# EAGLE design pocketmdm (EAGLE 7.2.0)
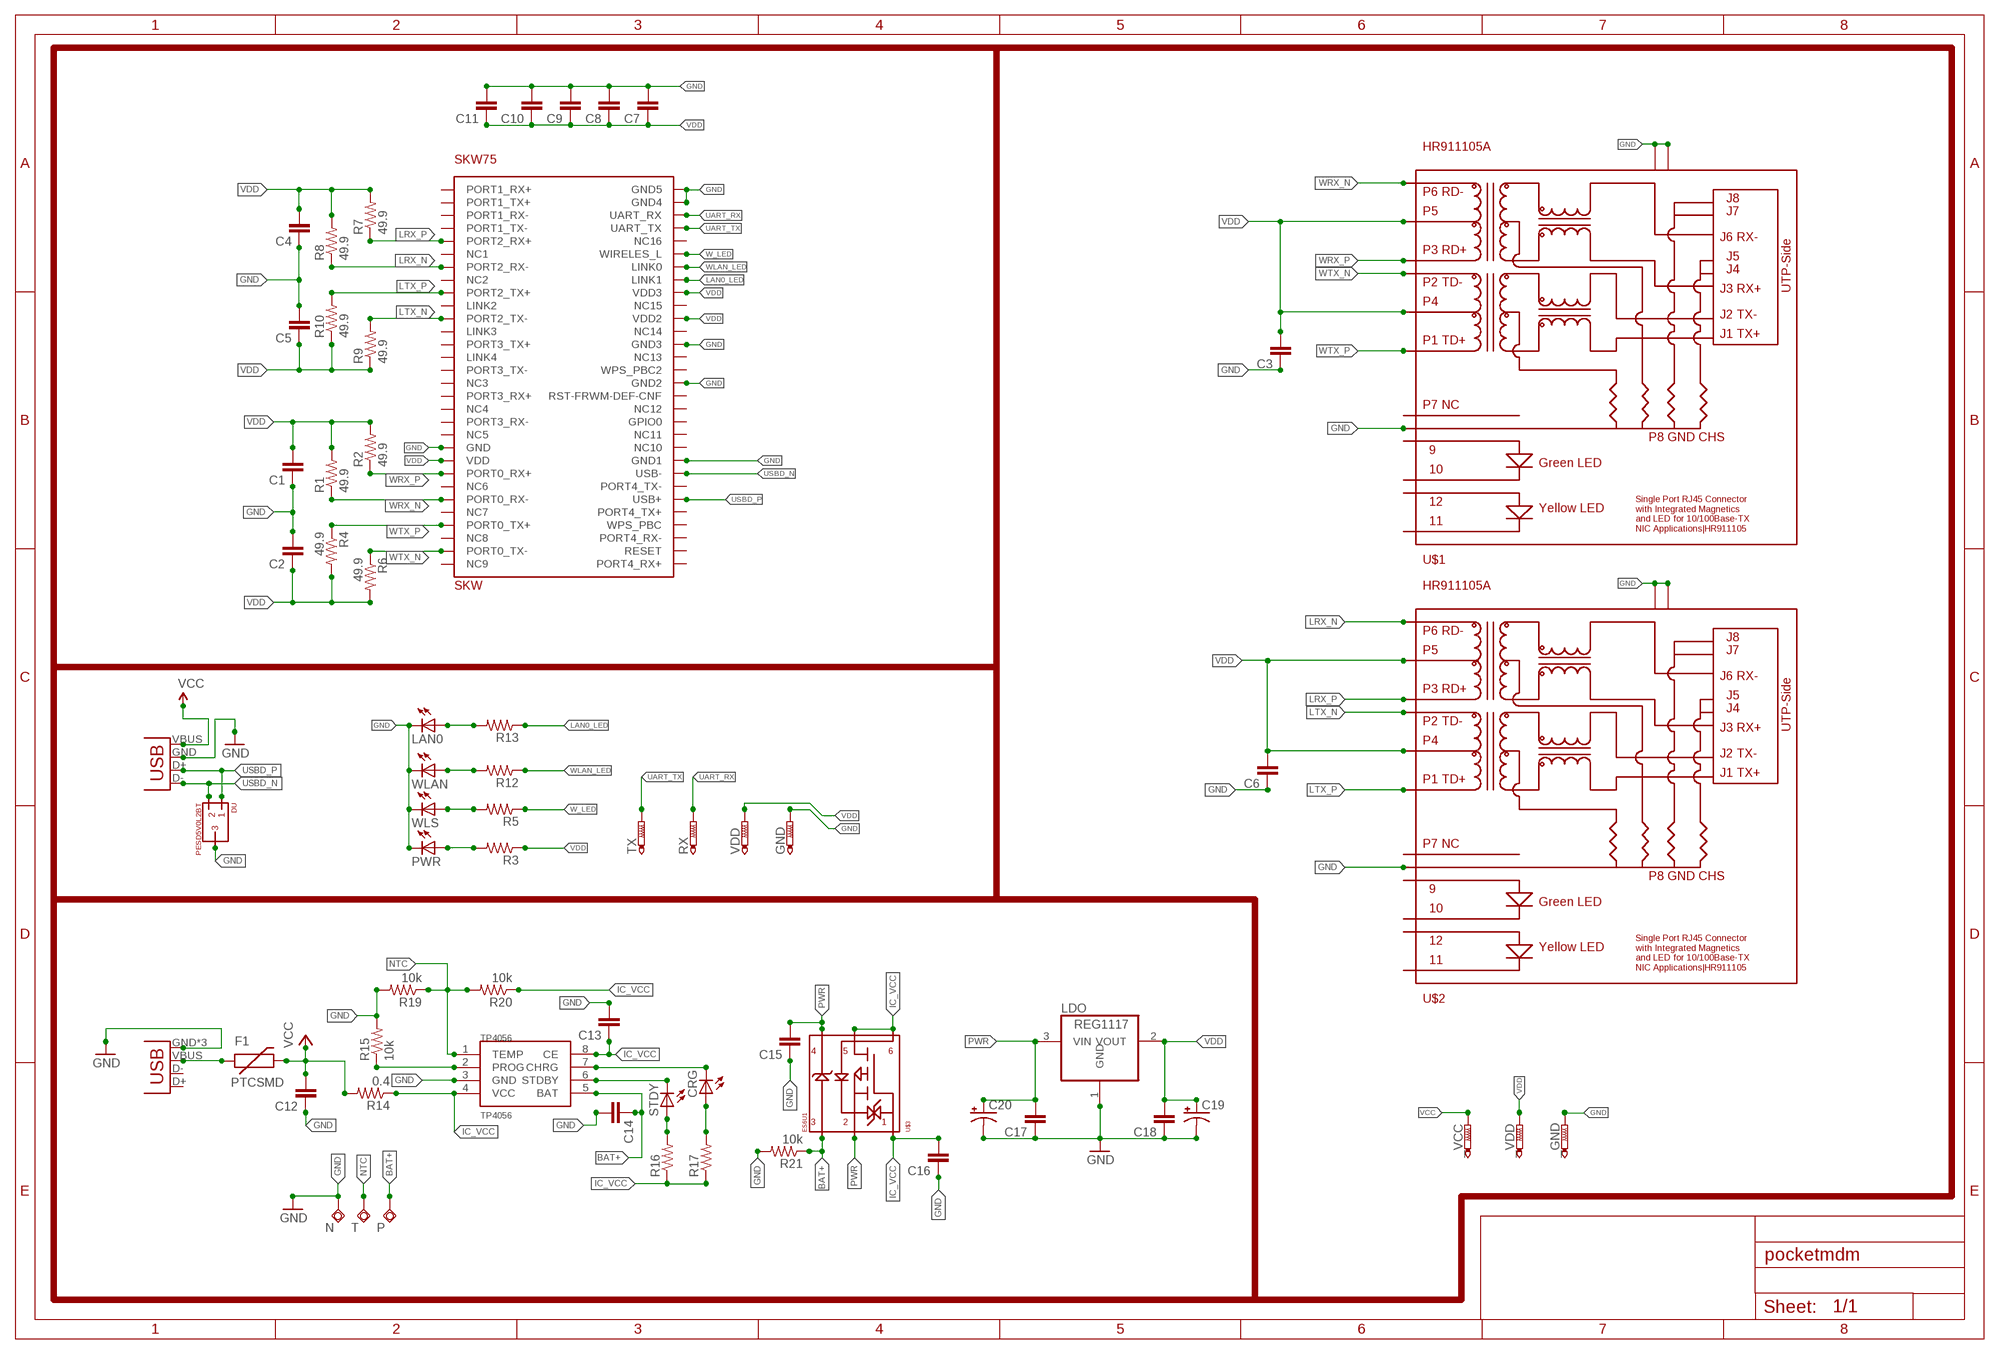
[diagram p0: schematic, sheet 1]

## Parts
_GND  PTR1B1,27  [B1,27]
_VCC  PTR1B1,27  [B1,27]
_VDD  PTR1B1,27  [B1,27]
C1  CAP0402-CAP  [0402-CAP]
C2  CAP0402-CAP  [0402-CAP]
C3  CAP0402-CAP  [0402-CAP]
C4  CAP0402-CAP  [0402-CAP]
C5  CAP0402-CAP  [0402-CAP]
C6  CAP0402-CAP  [0402-CAP]
C7  CAP0402-CAP  [0402-CAP]
C8  CAP0402-CAP  [0402-CAP]
C9  CAP0402-CAP  [0402-CAP]
C10  CAP0402-CAP  [0402-CAP]
C11  CAP0402-CAP  [0402-CAP]
C12  CAP0402-CAP  [0402-CAP]
C13  CAP0402-CAP  [0402-CAP]
C14  CAP0402-CAP  [0402-CAP]
C15  CAP0402-CAP  [0402-CAP]
C16  CAP0402-CAP  [0402-CAP]
C17  CAP0402-CAP  [0402-CAP]
C18  CAP0402-CAP  [0402-CAP]
C19  CAP_POLPTH1  [CPOL-RADIAL-100UF-25V]
C20  CAP_POLPTH1  [CPOL-RADIAL-100UF-25V]
CRG  LEDCHIPLED_0603  [CHIPLED_0603]
DU  PESD5V0L2BT  [SOT23]
F1  PTCSMD  [PTC-1206]
GND  PTR1B1,27  [B1,27]
LAN0  LEDCHIPLED_0603  [CHIPLED_0603]
LDO  REG1117  [SOT223]
N  TPSQTP20SQ  [TP20SQ]
P  TPSQTP20SQ  [TP20SQ]
PWR  LEDCHIPLED_0603  [CHIPLED_0603]
R1  49.9  RESISTOR0402-RES  [0402-RES]
R2  49.9  RESISTOR0402-RES  [0402-RES]
R3  RESISTOR0402-RES  [0402-RES]
R4  49.9  RESISTOR0402-RES  [0402-RES]
R5  RESISTOR0402-RES  [0402-RES]
R6  49.9  RESISTOR0402-RES  [0402-RES]
R7  49.9  RESISTOR0402-RES  [0402-RES]
R8  49.9  RESISTOR0402-RES  [0402-RES]
R9  49.9  RESISTOR0402-RES  [0402-RES]
R10  49.9  RESISTOR0402-RES  [0402-RES]
R12  RESISTOR0402-RES  [0402-RES]
R13  RESISTOR0402-RES  [0402-RES]
R14  0.4  RESISTOR0402-RES  [0402-RES]
R15  10k  RESISTOR0402-RES  [0402-RES]
R16  RESISTOR0402-RES  [0402-RES]
R17  RESISTOR0402-RES  [0402-RES]
R19  10k  RESISTOR0402-RES  [0402-RES]
R20  10k  RESISTOR0402-RES  [0402-RES]
R21  10k  RESISTOR0402-RES  [0402-RES]
RX  PTR1B1,27  [B1,27]
SKW  SKW75  [CON-60-127MMPTH]
STDY  LEDCHIPLED_0603  [CHIPLED_0603]
T  TPSQTP20SQ  [TP20SQ]
TP4056  TP4056  [SOP-8]
TX  PTR1B1,27  [B1,27]
U$1  HR911105A  [HR911105A]
U$2  HR911105A  [HR911105A]
U$3  ES6U1  [WEMT6]
USBA  USB-A-H  [USB-A-H]
USBM  USB-MICROB  [USB-MICROB]
VDD  PTR1B1,27  [B1,27]
WLAN  LEDCHIPLED_0603  [CHIPLED_0603]
WLS  LEDCHIPLED_0603  [CHIPLED_0603]

## Nets
BAT+: C14.1 P.TP R21.1 TP4056.5(BAT) U$3.P$3
GND: _GND.TP C1.1 C2.2 C3.1 C4.1 C5.2 C6.1 C7.2 C8.2 C9.2 C10.2 C11.2 C12.1 C13.2 C14.2 C15.1 C16.1 C17.1 C18.1 C19.2(-) C20.2(-) DU.3 GND.TP LAN0.C LDO.1(GND) N.TP PWR.C R15.2 R19.2 R21.2 SKW.P$21(GND) SKW.P$39(GND1) SKW.P$45(GND2) SKW.P$48(GND3) SKW.P$59(GND4) SKW.P$60(GND5) TP4056.3(GND) U$1.P$8 U$1.P$13 U$1.P$14 U$2.P$8 U$2.P$13 U$2.P$14 USBA.GND(VBUS) USBM.GND USBM.MT1(GND) USBM.MT2(GND) WLAN.C WLS.C
IC_VCC: C13.1 C16.2 R14.1 R16.1 R17.1 R20.1 TP4056.4(VCC) TP4056.8(CE) U$3.P$1 U$3.P$5 U$3.P$6
LAN0_LED: R13.1 SKW.P$53(LINK1)
LRX_N: R8.1 SKW.P$7(PORT2_RX-) U$2.P$6
LRX_P: R7.1 SKW.P$5(PORT2_RX+) U$2.P$3
LTX_N: R9.2 SKW.P$11(PORT2_TX-) U$2.P$2
LTX_P: R10.2 SKW.P$9(PORT2_TX+) U$2.P$1
N$2: CRG.C TP4056.7(CHRG)
N$4: F1.1 USBM.VBUS
N$7: R15.1 TP4056.2(PROG)
N$8: STDY.C TP4056.6(STDBY)
N$9: PWR.A R3.2
N$10: R5.2 WLS.A
N$11: R12.2 WLAN.A
N$16: R16.2 STDY.A
N$19: CRG.A R17.2
N$21: LAN0.A R13.2
NTC: R19.1 R20.2 T.TP TP4056.1(TEMP)
PWR: C15.2 C17.2 C20.1(+) LDO.3(VIN) U$3.P$2 U$3.P$4
UART_RX: RX.TP SKW.P$58(UART_RX)
UART_TX: SKW.P$57(UART_TX) TX.TP
USBD_N: DU.2 SKW.P$38(USB-) USBA.D-(D+)
USBD_P: DU.1 SKW.P$36(USB+) USBA.D+(D-)
VCC: _VCC.TP C12.2 F1.2 R14.2 USBA.VBUS(GND)
VDD: _VDD.TP C1.2 C2.1 C3.2 C4.2 C5.1 C6.2 C7.1 C8.1 C9.1 C10.1 C11.1 C18.2 C19.1(+) LDO.2(VOUT) R1.2 R2.2 R3.1 R4.2 R6.2 R7.2 R8.2 R9.1 R10.1 SKW.P$22(VDD) SKW.P$50(VDD2) SKW.P$52(VDD3) U$1.P$4 U$1.P$5 U$2.P$4 U$2.P$5 VDD.TP
W_LED: R5.1 SKW.P$55(WIRELES_L)
WLAN_LED: R12.1 SKW.P$54(LINK0)
WRX_N: R1.1 SKW.P$25(PORT0_RX-) U$1.P$6
WRX_P: R2.1 SKW.P$23(PORT0_RX+) U$1.P$3
WTX_N: R6.1 SKW.P$29(PORT0_TX-) U$1.P$2
WTX_P: R4.1 SKW.P$27(PORT0_TX+) U$1.P$1
Unconnected: SKW.P$1(PORT1_RX+) SKW.P$2(PORT1_TX+) SKW.P$3(PORT1_RX-) SKW.P$4(PORT1_TX-) SKW.P$6(NC1) SKW.P$8(NC2) SKW.P$10(LINK2) SKW.P$12(LINK3) SKW.P$13(PORT3_TX+) SKW.P$14(LINK4) SKW.P$15(PORT3_TX-) SKW.P$16(NC3) SKW.P$17(PORT3_RX+) SKW.P$18(NC4) SKW.P$19(PORT3_RX-) SKW.P$20(NC5) SKW.P$24(NC6) SKW.P$26(NC7) SKW.P$28(NC8) SKW.P$30(NC9) SKW.P$31(PORT4_RX+) SKW.P$32(RESET) SKW.P$33(PORT4_RX-) SKW.P$34(WPS_PBC) SKW.P$35(PORT4_TX+) SKW.P$37(PORT4_TX-) SKW.P$40(NC10) SKW.P$41(NC11) SKW.P$42(GPIO0) SKW.P$43(NC12) SKW.P$44(RST-FRWM-DEF-CNF) SKW.P$46(WPS_PBC2) SKW.P$47(NC13) SKW.P$49(NC14) SKW.P$51(NC15) SKW.P$56(NC16) U$1.P$7 U$1.P$9 U$1.P$10 U$1.P$11 U$1.P$12 U$2.P$7 U$2.P$9 U$2.P$10 U$2.P$11 U$2.P$12 USBM.D+ USBM.D-

## Library data of the parts
_GND _VCC _VDD GND RX TX VDD = testpad:PTR1: TEST PIN
C1-C18 = SparkFun-Capacitors:CAP: Capacitor Standard 0603 ceramic capacitor, and 0.1" leaded capacitor.
C19 C20 = SparkFun-Passives:CAP_POL: Capacitor Polarized These are standard SMD and PTH capacitors. Normally 10uF, 47uF, and 100uF in electrolytic and tantalum varieties. Always verify the external diameter of the through hole cap, it varies with capacity, voltage, and manufacturer. The EIA devices should be standard.
CRG LAN0 PWR STDY WLAN WLS = led:LED: LED OSRAM: - CHIPLED LG R971, LG N971, LY N971, LG Q971, LY Q971, LO R971, LY R971 LH N974, LH R974 LS Q976, LO Q976, LY Q976 LO Q996 - Hyper CHIPLED LW Q18S LB Q993, LB Q99A, LB R99A - SideLED LS A670, LO A670, LY A670, LG A670, LP A670 LB A673, LV A673, LT A673, LW A673 LH A674 LY A675 LS A676, LA A676, LO A676, LY A676, LW A676 LS A679, LY A679, LG A679 - Hyper Micro SIDELED® LS Y876, LA Y876, LO Y876, LY Y876 LT Y87S - SmartLED LW L88C, LW L88S LB L89C, LB L89S, LG L890 LS L89K, LO L89K, LY L89K LS L896, LA L896, LO L896, LY L896 - TOPLED LS T670, LO T670, LY T670, LG T670, LP T670 LSG T670, LSP T670, LSY T670, LOP T670, LYG T670 LG T671, LOG T671, LSG T671 LB T673, LV T673, LT T673, LW T673 LH T674 LS T676, LA T676, LO T676, LY T676, LB T676, LH T676, LSB T676, LW T676 LB T67C, LV T67C, LT T67C, LS T67K, LO T67K, LY T67K, LW E67C LS E67B, LA E67B, LO E67B, LY E67B, LB E67C, LV E67C, LT E67C LW T67C LS T679, LY T679, LG T679 LS T770, LO T770, LY T770, LG T770, LP T770 LB T773, LV T773, LT T773, LW T773 LH T774 LS E675, LA E675, LY E675, LS T675 LS T776, LA T776, LO T776, LY T776, LB T776 LHGB T686 LT T68C, LB T68C - Hyper Mini TOPLED® LB M676 - Mini TOPLED Santana® LG M470 LS M47K, LO M47K, LY M47K Source: http://www.osram.convergy.de LUXEON: - LUMILED® LXK2-PW12-R00, LXK2-PW12-S00, LXK2-PW14-U00, LXK2-PW14-V00 LXK2-PM12-R00, LXK2-PM12-S00, LXK2-PM14-U00 LXK2-PE12-Q00, LXK2-PE12-R00, LXK2-PE12-S00, LXK2-PE14-T00, LXK2-PE14-U00 LXK2-PB12-K00, LXK2-PB12-L00, LXK2-PB12-M00, LXK2-PB14-N00, LXK2-PB14-P00, LXK2-PB14-Q00 LXK2-PR12-L00, LXK2-PR12-M00, LXK2-PR14-Q00, LXK2-PR14-R00 LXK2-PD12-Q00, LXK2-PD12-R00, LXK2-PD12-S00 LXK2-PH12-R00, LXK2-PH12-S00 LXK2-PL12-P00, LXK2-PL12-Q00, LXK2-PL12-R00 Source: www.luxeon.com KINGBRIGHT: KA-3528ASYC Source: www.kingbright.com
DU = NXP_By_element14_Batch_1:PESD5V0L2BT
F1 = SparkFun-PowerIC:PTC: Resettable Fuse PTC Resettable Fuse. Spark Fun Electronics SKU : COM-08357; PROD_ID: RES-11150
LDO = burr-brown:REG1117: 800mA and 1A Low Dropout (LDO) Positive Regulator 1.8V, 2.5V, 2.85V, 3.3V, 5V, and Adj; MPN: REG1117; OC_FARNELL: 1097566; OC_NEWARK: 14P6981
N P T = testpad:TPSQ: Test pad
R1-R10 R12-R17 R19-R21 = SparkFun-Passives:RESISTOR: Resistor Basic schematic elements and footprints for 0603, 1206, and PTH resistors.
SKW = skw-75-lib:SKW75
TP4056 = TP4056:TP4056
U$1 U$2 = hanrun:HR911105A; LINK: http://www.aliexpress.com/item/Free-Shipping-20PCS-LOT-HR911105A-WIZNET-HR911105-HANRUN-Single-Port-RJ45-Connector-O-100/1039249300.html; PRICE: 0.67
U$3 = ES6U1:ES6U1
USBA = SparkFun-Connectors:USB: USB Connectors USB-B-PTH is fully proven SKU : PRT-00139/CONN-08278 USB-miniB is fully proven SKU : PRT-00587 USB-A-PCB is untested. USB-A-H is throughly reviewed, but untested. Spark Fun Electronics SKU : PRT-00437 USB-B-SMT is throughly reviewed, but untested. Needs silkscreen touching up. USB-A-S has not been used/tested USB-MB-H has not been used/tested USB-MICROB has been used. CONN-09505
USBM = SparkFun-Connectors:USB: USB Connectors USB-B-PTH is fully proven SKU : PRT-00139/CONN-08278 USB-miniB is fully proven SKU : PRT-00587 USB-A-PCB is untested. USB-A-H is throughly reviewed, but untested. Spark Fun Electronics SKU : PRT-00437 USB-B-SMT is throughly reviewed, but untested. Needs silkscreen touching up. USB-A-S has not been used/tested USB-MB-H has not been used/tested USB-MICROB has been used. CONN-09505; PROD_ID: CONN-09505

## Board
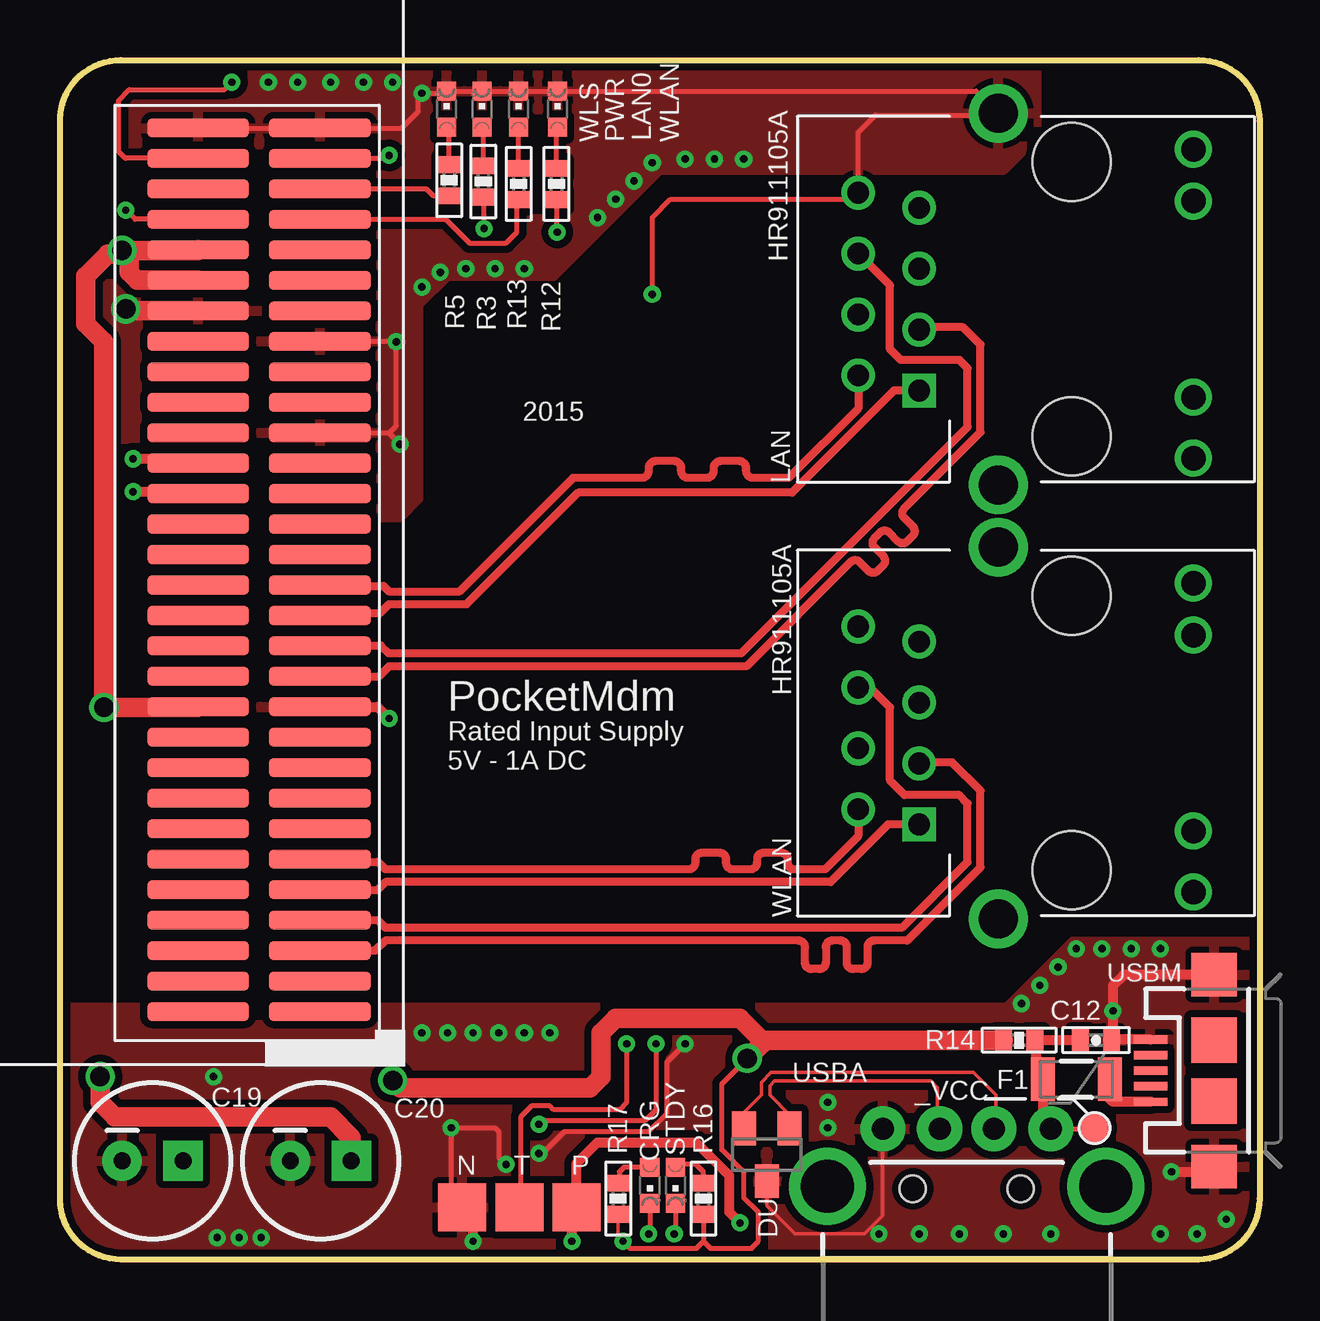
[diagram p1: board, top side]
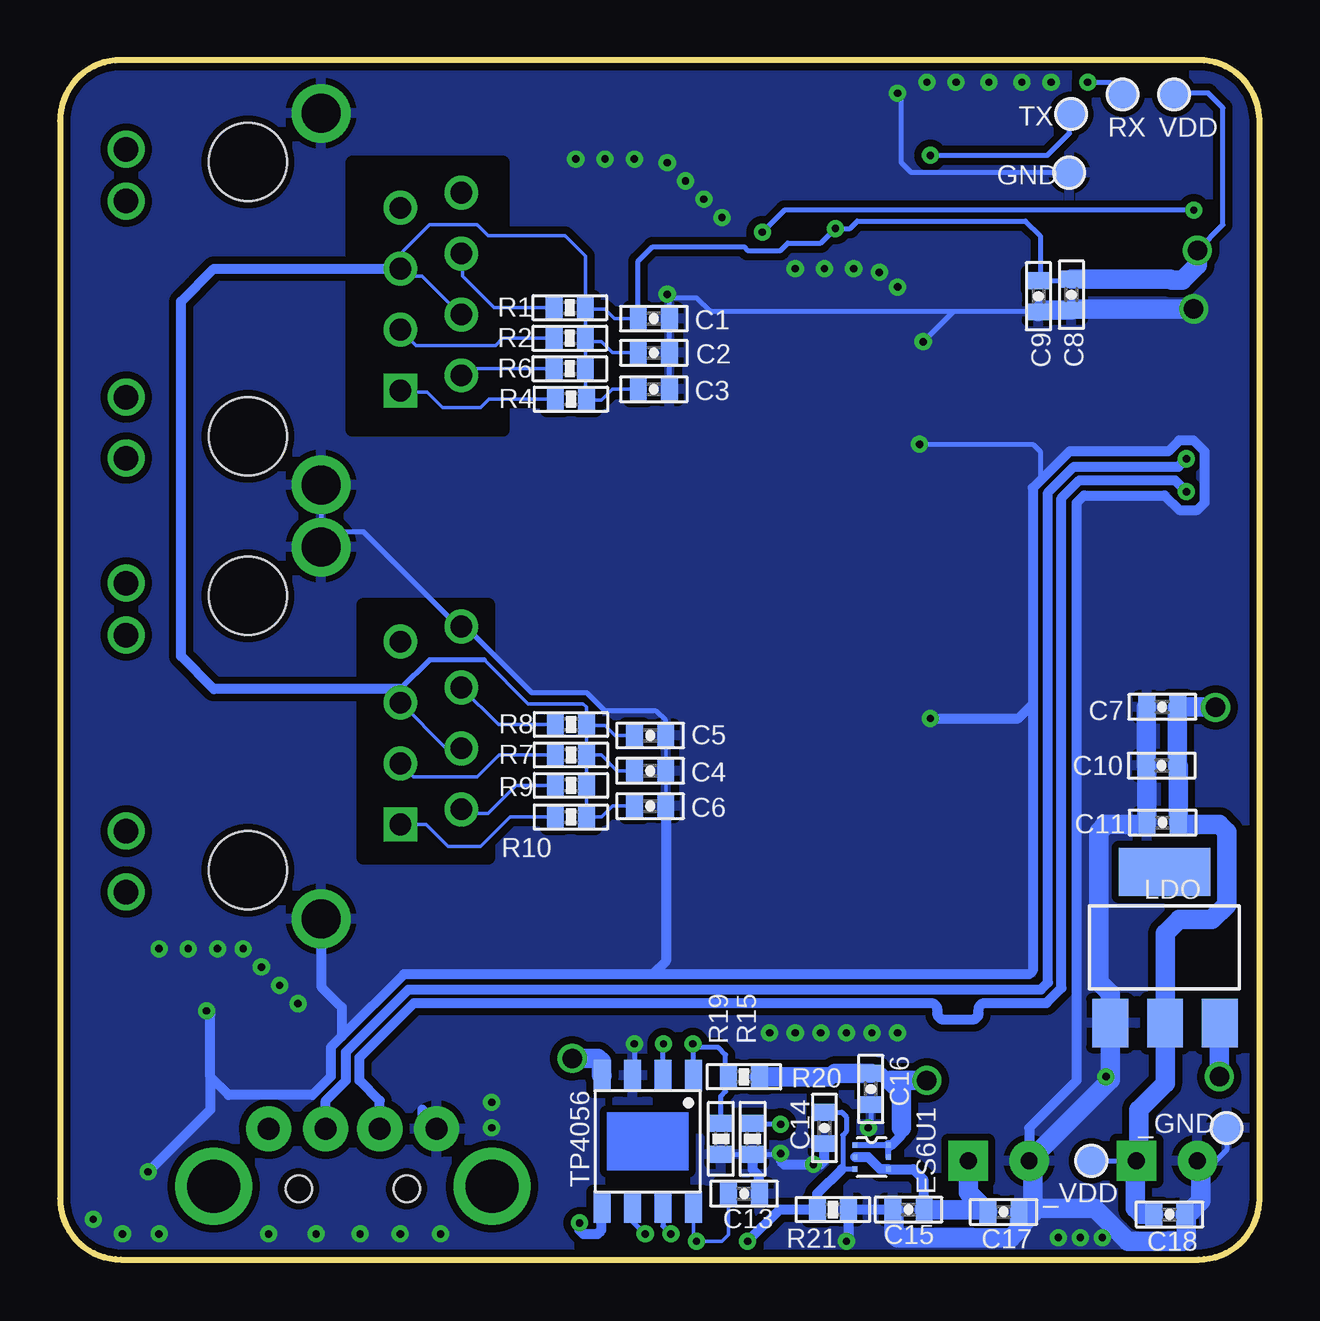
[diagram p2: board, bottom side, seen from below]

Size 50 x 50 mm. Coordinates in mm from the lower left corner, seen from the top.
Outline: 47.46,0 2.54,0 arc-90 0,2.54 0,47.46 arc-90 2.54,50 47.46,50 arc-90 50,47.46 50,2.54 arc-90 47.46,0
Copper layers (1*16): Top 0.035mm / dielectric 1.5mm / Bottom 0.035mm
Design rules "pocketmdm-dru *": minimum track width 6mil, minimum drill 12mil, track to track 6mil, track to pad 6mil, pad to pad 6mil, via to via 6mil, smd to smd 6mil, copper to edge 6mil, drill to drill 6mil, minimum pad ring 10mil, minimum via ring 8mil, stop-mask expansion 4mil, vias tented up to drill 0mil, thermal gap 10mil
bRestrict: area 32.2,16.8 to 37.3,27.3; area 31.5,34.6 to 37.8,45.7

### Footprints (pad centres in the part's own frame; a part is rotated, then mirrored left to right if it is on the bottom)
B1,27 = smd 1.27 x 1.27: TP 0,0
0402-CAP = smd 0.7 x 0.9: 1 -0.65,0; 2 0.65,0
CPOL-RADIAL-100UF-25V = drill 0.7 pad 1.651 square: 1 1.27,0 | drill 0.7 pad 1.651: 2 -1.27,0
CHIPLED_0603 = smd 0.8 x 0.8: A 0,-0.75; C 0,0.75
SOT23 = smd 1 x 1.4: 1 -0.95,-1.1; 2 0.95,-1.1; 3 0,1.1
PTC-1206 = smd 1 x 1.8: 1 -1.4,0; 2 1.4,0
SOT223 = smd 1.499 x 2.007: 1 -2.261,-3.15; 2 0.025,-3.15; 3 2.311,-3.15 | smd 3.81 x 2.007: 4 0,3.15
TP20SQ = smd 2 x 2: TP 0,0
0402-RES = smd 0.7 x 0.9: 1 -0.65,0; 2 0.65,0
CON-60-127MMPTH = smd 4.25 x 0.8: P$1 -2.54,17.78; P$2 2.54,17.78; P$3 -2.54,16.51; P$4 2.54,16.51; P$5 -2.54,15.24; P$6 2.54,15.24; P$7 -2.54,13.97; P$8 2.54,13.97; P$9 -2.54,12.7; P$10 2.54,12.7; P$11 -2.54,11.43; P$12 2.54,11.43; P$13 -2.54,10.16; P$14 2.54,10.16; P$15 -2.54,8.89; P$16 2.54,8.89; P$17 -2.54,7.62; P$18 2.54,7.62; P$19 -2.54,6.35; P$20 2.54,6.35; P$21 -2.54,5.08; P$22 2.54,5.08; P$23 -2.54,3.81; P$24 2.54,3.81; P$25 -2.54,2.54; P$26 2.54,2.54; P$27 -2.54,1.27; P$28 2.54,1.27; P$29 -2.54,0; P$30 2.54,0; P$31 -2.54,-1.27; P$32 2.54,-1.27; P$33 -2.54,-2.54; P$34 2.54,-2.54; P$35 -2.54,-3.81; P$36 2.54,-3.81; P$37 -2.54,-5.08; P$38 2.54,-5.08; P$39 -2.54,-6.35; P$40 2.54,-6.35; P$41 -2.54,-7.62; P$42 2.54,-7.62; P$43 -2.54,-8.89; P$44 2.54,-8.89; P$45 -2.54,-10.16; P$46 2.54,-10.16; P$47 -2.54,-11.43; P$48 2.54,-11.43; P$49 -2.54,-12.7; P$50 2.54,-12.7; P$51 -2.54,-13.97; P$52 2.54,-13.97; P$53 -2.54,-15.24; P$54 2.54,-15.24; P$55 -2.54,-16.51; P$56 2.54,-16.51; P$57 -2.54,-17.78; P$58 2.54,-17.78; P$59 -2.54,-19.05; P$60 2.54,-19.05
SOP-8 = smd 1.3 x 0.7: 1 -2.75,1.905; 2 -2.75,0.635; 3 -2.75,-0.635; 4 -2.75,-1.905; 5 2.75,-1.905; 6 2.75,-0.635; 7 2.75,0.635; 8 2.75,1.905
HR911105A = drill 0.9 square: P$1 3.81,0 | drill 0.9: P$2 3.18,-2.54; P$3 1.27,0; P$4 0.64,-2.54; P$5 -1.27,0; P$6 -1.9,-2.54; P$7 -3.81,0; P$8 -4.44,-2.54 | drill 1.02: P$9 6.625,11.43; P$10 4.085,11.43; P$11 -4.085,11.43; P$12 -6.25,11.43 | drill 1.63: P$13 -7.745,3.3; P$14 7.745,3.3 | hole 3.25: -5.715,6.35; 5.715,6.35
WEMT6 = smd 0.22 x 0.21: P$1 -0.5,0.105; P$2 0,0.105; P$3 0.5,0.105; P$4 0.5,1.495; P$5 0,1.495; P$6 -0.5,1.495
USB-A-H = drill 0.914 pad 1.88: D+ 2.4,1.127; D- 2.4,-1.127; GND 2.4,3.5; VBUS 2.4,-3.5 | drill 2.2: GND2 0,-5.8; GND3 0,5.8 | hole 1.1: -0.1,2.25; -0.1,-2.25
USB-MICROB = smd 0.35 x 1.4: D+ 0,2.65; D- -0.65,2.65; GND 1.3,2.65; ID 0.65,2.65; VBUS -1.3,2.65 | smd 1.8 x 1.9: MT1 -4,0; MT2 4,0 | smd 1.9 x 1.9: P$1 -1.27,0; P$2 1.27,0

### Placement (x,y rotation side)
_GND  1.37,5.49 0 bottom
_VCC  43.13,5.49 0 top
_VDD  7.01,4.11 0 bottom
C1  25.25,39.22 180 bottom
C2  25.25,37.79 0 bottom
C3  25.25,36.27 180 bottom
C4  25.4,20.37 180 bottom
C5  25.4,21.84 0 bottom
C6  25.4,18.9 180 bottom
C7  4.05,23.04 180 bottom
C8  7.84,40.22 270 bottom
C9  9.21,40.15 270 bottom
C10  4.07,20.59 180 bottom
C11  4.04,18.21 180 bottom
C12  43.18,9.14 180 top
C13  21.49,2.74 0 bottom
C14  18.14,5.49 270 bottom
C15  14.63,2.08 0 bottom
C16  16.21,7.11 90 bottom
C17  10.67,1.98 180 bottom
C18  3.76,1.88 180 bottom
C19  3.86,4.11 0 top
C20  10.87,4.11 0 top
CRG  24.59,3.1 180 top
DU  29.46,4.37 180 top
F1  42.37,7.52 180 top
GND  7.93,45.3 90 bottom
LAN0  19.12,47.95 0 top
LDO  3.96,13 0 bottom
N  16.76,2.18 0 top
P  21.54,2.18 0 top
PWR  17.59,47.95 0 top
R1  28.75,39.67 0 bottom
R2  28.75,38.4 0 bottom
R3  17.65,44.93 90 top
R4  28.7,35.86 0 bottom
R5  16.22,44.98 90 top
R6  28.75,37.13 0 bottom
R7  28.7,21.03 0 bottom
R8  28.7,22.3 0 bottom
R9  28.7,19.76 180 bottom
R10  28.7,18.44 180 bottom
R12  20.69,44.83 90 top
R13  19.12,44.83 90 top
R14  39.98,9.14 0 top
R15  21.13,5.03 270 bottom
R16  26.82,2.54 90 top
R17  23.27,2.54 90 top
R19  22.45,5.03 270 bottom
R20  21.49,7.62 180 bottom
R21  17.78,2.08 0 bottom
RX  5.71,48.55 90 bottom
SKW  8.3,28.12 180 top
STDY  25.65,3.1 180 top
T  19.15,2.18 0 top
TP4056  25.5,4.93 270 bottom
TX  7.85,47.74 90 bottom
U$1  35.81,40.03 270 top
U$2  35.81,21.95 270 top
U$3  16.97,4.27 270 bottom
USBA  37.8,3.05 90 top
USBM  48.11,7.87 90 top
VDD  3.57,48.55 90 bottom
WLAN  20.74,47.95 0 top
WLS  16.12,47.95 0 top

### Tracks (layer width: path | path; a pad name or v marks a point on that pad's centre or on a via)
BAT+  (via drill 0.3)
  Top 0.406: v21.34,0.76 21.34,1.98 P.TP 21.54,4.01 22.4,4.88 26.52,4.88 27.89,3.5 27.89,1.98 v28.35,1.52
  Bottom 0.203: U$3.P$3 17.42,3.77 17.37,3.81 17.37,5.18 17.22,5.33 17.22,5.94 17.41,6.14 C14.1
  Bottom 0.406: v21.34,0.76 20.02,2.08 R21.1 18.44,2.09 18.44,2.74 17.42,3.77 | v28.35,1.52 28.35,1.22 28.19,1.07 27.58,1.07 27.43,1.22 27.43,2.15 TP4056.5
GND  (via drill 0.3, 0.81)
  Top 0.152: DU.3 29.46,2.23 30.63,1.07 33.53,1.07 34.29,1.83 USBA.GND
  Top 0.203: v19.96,4.42 20.12,4.42 21.03,5.33 24.54,5.33 25.3,6.1 25.3,8.23 v26.06,8.99 | N.TP 16.31,2.64 v16.31,5.49 18.14,5.49 18.29,5.33 18.29,4.27 v18.59,3.96 | SKW.P$59 SKW.P$60 14.25,47.17 14.94,47.85 14.94,48.46 v15.09,48.62 16.03,48.62 WLS.C PWR.C LAN0.C WLAN.C 38.19,48.7 U$1.P$13 39.04,47.7 33.98,47.7 33.27,46.99 U$1.P$8 33,44.2 25.45,44.2 24.69,43.43 v24.69,40.23 | SKW.P$45 10.86,38.25 v14.02,38.25 14.02,34.75 13.74,34.47 SKW.P$39 13.69,34.47 v14.17,33.98
  Top 0.406: v17.22,0.76 17.22,1.73 N.TP | USBM.GND 43.86,9.17 C12.1 43.89,9.21 v43.89,10.36 43.89,11.43 44.34,11.87 USBM.MT2 | SKW.P$21 13.23,23.04 v13.72,22.55 | v46.33,3.66 47.89,3.66 USBM.MT1
  Top 0.813: SKW.P$48 2.82,39.55 v2.74,39.62
  Bottom 0.152: C5.2 C4.1 C6.1
  Bottom 0.203: R19.2 R15.2 20,4.38 v19.96,4.42 | v26.06,8.99 26.06,7.75 TP4056.3 | C16.1 16.2,5.59 v16.31,5.49 | GND.TP 14.52,45.3 14.94,45.72 14.94,48.46 v15.09,48.62 | C3.1 C2.2 C1.1 24.6,40.14 v24.69,40.23 24.54,40.08 23.47,40.08 22.89,39.5 C9.2 12.77,39.5 v14.02,38.25 | v14.17,33.98 9.45,33.98 9.14,33.68 9.14,32.61 9.07,32.54 | C5.2 24.75,22.46 25.15,22.86 27.28,22.86 28.04,23.62 30.33,23.62 32.77,26.06 32.95,26.06 U$2.P$8 33.4,26.39 37.34,30.33 38.47,30.33 U$2.P$13 U$1.P$14 | _GND.TP 1.37,4.57 1.83,4.12 C19.2
  Bottom 0.406: 43.74,7.62 42.98,6.86 39.47,6.86 38.71,7.62 38.71,8.84 38.25,9.3 | 43.74,7.62 43.74,10.21 v43.89,10.36 | v19.96,4.42 19.96,4.12 19.81,3.96 v18.59,3.96 18.29,3.96 18.14,4.12 C14.2 | R15.2 21.13,3.76 20.88,3.5 20.88,2.78 C13.2 | v17.22,0.76 17.13,0.85 R21.2 C15.1 | 34.9,6.25 34.9,6.05 USBA.GND | U$2.P$14 39.11,11.37 38.25,10.52 38.25,9.3 | 43.74,7.62 43.74,6.25 v46.33,3.66 | C6.1 24.75,12.44 25.3,11.89 | C20.2 9.6,5.49 7.62,7.47 7.62,31.55 7.32,31.85 3.96,31.85 3.35,31.24 2.59,31.24 2.29,31.55 2.29,33.68 2.74,34.14 3.35,34.14 3.81,33.68 7.92,33.68 9.07,32.54 9.45,32.16 9.45,23.16 | 9.45,23.16 9.45,12.04 9.6,11.89 25.3,11.89 | 25.3,11.89 35.66,11.89 38.25,9.3 | v13.72,22.55 10.06,22.55 9.45,23.16
  Bottom 0.813: 10.02,1.37 C17.1 9.6,1.98 9.45,2.13 6.86,2.13 5.49,0.76 3.2,0.76 3.05,0.91 3.05,1.83 3,1.88 | 10.02,1.37 10.02,1.26 10.36,0.91 15.09,0.91 15.24,1.07 15.24,2.04 C15.1 | C18.1 3,1.88 | 3,1.88 2.44,2.44 2.44,3.96 C19.2 | 10.02,1.37 9.45,1.94 9.45,3.96 C20.2 6.22,7.49 LDO.1 6.22,11.1 6.71,11.58 6.71,17.83 6.4,18.14 4.77,18.14 C11.2 4.69,20.55 C10.2 4.72,23.01 C7.2 | C9.2 9.15,39.57 C8.2 7.78,39.62 v2.74,39.62
  other vias: 15.09,9.45 16.15,9.45 17.22,9.45 18.29,9.45 19.35,9.45 20.42,9.45 40.08,10.67 40.84,11.43 41.61,12.19 42.37,12.95 43.43,12.95 44.65,12.95 45.87,12.95 34.14,1.07 35.81,1.07 37.49,1.07 39.32,1.07 41.3,1.07 45.87,1.07 47.4,1.07 48.62,1.68 15.09,40.54 15.85,41.15 16.92,41.3 18.14,41.3 19.35,41.3 22.4,43.43 23.16,44.2 23.93,44.96 24.69,45.72 26.06,45.87 27.28,45.87 28.5,45.87 6.4,7.62 32,6.55 32,5.49 6.55,0.91 7.47,0.91 8.38,0.91 8.69,49.07 9.91,49.07 11.28,49.07 12.65,49.07 13.87,49.07
  pour Bottom (isolate 0.305): -2.44,52.27 52.12,52.27 52.12,-3.51 -2.44,-3.51
  pour Top (isolate 0.305): -1.68,10.52 39.47,10.52 42.21,13.26 53.04,13.26 53.04,-1.68 -1.37,-1.68 -1.52,-1.52 -1.52,9.6 -1.68,9.75
  pour Top (isolate 0.305): -2.44,10.06 -2.44,52.43 -1.83,53.04 39.78,53.04 40.69,52.12 40.69,46.79 39.32,45.42 24.99,45.42 20.57,41 16.15,41 14.94,39.78 14.94,31.7 14.17,30.94 10.82,30.94 8.99,29.11 8.99,9.91 8.38,9.3 -1.68,9.3
IC_VCC  (via drill 0.3, 0.81)
  Top 0.152: R17.1 23.27,0.96 v23.47,0.76
  Top 0.203: v28.65,8.38 27.58,7.32 27.58,4.57 28.5,3.66 28.5,2.59 29.11,1.98 29.11,0.76 28.8,0.46 27.13,0.46 26.82,0.76 | R16.1 26.82,0.76 | 26.82,0.76 26.52,0.46 23.77,0.46 v23.47,0.76
  Top 0.813: R14.1 29.26,9.14 | 29.26,9.14 28.35,10.06 23.16,10.06 22.55,9.45 22.55,7.62 22.1,7.16 14.17,7.16 v13.87,7.47 | 29.26,9.14 29.26,8.99 v28.65,8.38
  Bottom 0.152: v23.47,0.76 23.16,0.76 | C13.1 22.14,1.03 22.4,0.76 v23.47,0.76 | TP4056.8 23.6,0.89 v23.47,0.76
  Bottom 0.254: U$3.P$5 U$3.P$6 U$3.P$1
  Bottom 0.406: U$3.P$6 15.35,4.77 14.94,5.18 14.94,5.49 | C16.2 15.69,7.76 15.38,7.46 | 17.67,7.76 17.84,7.76 17.98,7.62
  Bottom 0.813: v28.65,8.38 27.58,8.38 27.43,8.23 27.43,7.7 TP4056.4 | 14.94,5.49 14.94,7.01 15.38,7.46 15.37,7.47 v13.87,7.47 | C16.2 17.67,7.76 | 17.98,7.62 R20.1
LAN0_LED
  Top 0.203: SKW.P$53 16.08,43.36 17.07,42.37 18.59,42.37 19.05,42.82 19.05,44.11 R13.1
LRX_N
  Top 0.331: SKW.P$7 13.25,14.15 13.56,13.83 35.09,13.83 37.83,16.57 37.83,19.01 37.49,19.36 35.2,19.36 34.59,19.96 34.59,23.01 33.83,23.77 33.34,23.77 U$2.P$6
  Bottom 0.152: R8.1 31.73,22.3 U$2.P$6
LRX_P
  Top 0.331: SKW.P$5 13.14,12.88 13.56,13.3 30.79,13.3 arc-90 31.05,13.03 31.05,12.38 arc90 31.32,12.11 31.66,12.11 arc90 31.92,12.38 31.92,13.03 arc-90 32.19,13.3 32.53,13.3 arc-90 32.79,13.03 32.79,12.38 arc90 33.06,12.11 33.4,12.11 arc90 33.66,12.38 33.66,13.03 arc-90 33.93,13.3 35.31,13.3 38.37,16.35 38.37,19.55 37.19,20.73 35.86,20.73 U$2.P$3
  Bottom 0.152: R7.1 31.7,21.03 32.61,20.12 35.25,20.12 U$2.P$3
LTX_N
  Top 0.331: U$2.P$2 33.27,17.65 31.89,16.27 30.61,16.27 arc-90 30.34,16.54 30.34,16.68 arc90 30.07,16.95 29.32,16.95 arc90 29.05,16.68 29.05,16.54 arc-90 28.79,16.27 28.03,16.27 arc-90 27.77,16.54 27.77,16.68 arc90 27.5,16.95 26.75,16.95 arc90 26.48,16.68 26.48,16.54 arc-90 26.21,16.27 13.56,16.27 13.26,16.57 10.95,16.57 SKW.P$11
  Bottom 0.152: R9.2 30.99,19.76 32.16,18.59 33.1,18.59 U$2.P$2
LTX_P
  Top 0.331: U$2.P$1 34.52,18.14 32.12,15.73 13.56,15.73 13.24,15.42 SKW.P$9 10.86,15.39
  Bottom 0.152: R10.2 31.24,18.44 32.46,17.22 33.83,17.22 34.75,18.14 U$2.P$1
N$2  (via drill 0.3)
  Top 0.203: CRG.C 24.59,1.12 v24.54,1.07
  Bottom 0.203: TP4056.7 24.87,1.4 v24.54,1.07
N$4
  Top 0.406: USBM.VBUS 43.87,6.57 43.74,6.71 43.74,7.49 F1.1
N$7  (via drill 0.3)
  Top 0.203: v24.84,8.99 24.84,6.25 24.38,5.79 20.12,5.79 v19.96,5.64
  Bottom 0.203: TP4056.2 24.87,8.97 v24.84,8.99 | v19.96,5.64 21.09,5.64 R15.1
N$8  (via drill 0.3)
  Top 0.203: STDY.C 25.65,1.12 v25.6,1.07
  Bottom 0.203: TP4056.6 26.14,1.6 v25.6,1.07
N$9
  Top 0.203: R3.2 17.65,47.15 PWR.A
N$10
  Top 0.203: R5.2 16.22,47.1 WLS.A
N$11
  Top 0.203: R12.2 20.7,47.15 WLAN.A
N$16
  Top 0.203: R16.2 26.82,3.66 26.52,3.96 25.77,3.96 STDY.A
N$19
  Top 0.203: CRG.A 23.51,3.85 23.32,3.66 23.32,3.24 R17.2
N$21
  Top 0.203: R13.2 LAN0.A
NTC  (via drill 0.3)
  Top 0.203: v23.62,8.99 23.62,6.55 23.32,6.25 20.57,6.25 20.42,6.4 19.66,6.4 19.2,5.94 19.2,2.23 T.TP 19.36,2.39
  Bottom 0.203: TP4056.1 23.6,8.97 v23.62,8.99 23.47,8.84 22.55,8.84 22.25,8.53 22.25,7.51 | R19.1 22.45,6.81 22.25,7.01 22.25,7.51 | 22.25,7.51 R20.2
PWR  (via drill 0.81)
  Top 0.813: C20.1 12.14,5.08 11.28,5.94 2.29,5.94 1.68,6.55 v1.68,7.62
  Bottom 0.406: U$3.P$2 16.31,4.27 15.81,3.77 U$3.P$4 14.44,3.77 14.02,3.35 14.02,2.12 C15.2
  Bottom 0.813: C15.2 11.42,2.08 C17.2 12.14,2.8 C20.1 | v1.68,7.62 1.68,9.83 LDO.3
UART_RX  (via drill 0.3)
  Top 0.203: SKW.P$58 2.72,45.9 2.44,46.18 2.44,48.31 2.9,48.77 6.86,48.77 v7.16,49.07
  Bottom 0.203: v7.16,49.07 6.23,49.07 RX.TP
UART_TX  (via drill 0.3)
  Top 0.203: SKW.P$57 13.59,45.9 v13.72,46.02
  Bottom 0.203: v13.72,46.02 8.84,46.02 7.92,46.94 7.92,47.67 TX.TP
USBD_N  (via drill 0.3)
  Top 0.152: DU.2 28.51,6.14 29.23,6.86 29.23,7.39 29.64,7.8 38.08,7.8 39.01,6.86 39.01,5.54 USBA.D-
  Top 0.406: v3.05,33.38 5.58,33.38 SKW.P$38
  Bottom 0.406: USBA.D- 38.92,6.62 38.08,7.47 38.08,8.65 35.47,11.25 9.11,11.25 8.81,11.55 8.81,31.97 7.74,33.05 3.38,33.05 v3.05,33.38
USBD_P  (via drill 0.3)
  Top 0.152: DU.1 30.41,6.04 29.59,6.86 29.59,7.24 29.79,7.44 36.3,7.44 36.58,7.16 36.58,5.54 USBA.D+
  Top 0.406: v3.05,32 5.68,32 SKW.P$36
  Bottom 0.406: USBA.D+ 36.67,6.62 37.52,7.47 37.52,8.42 35.24,10.69 13.71,10.69 arc90 13.44,10.41 13.44,10.28 arc-90 13.15,10 11.99,10 arc-90 11.71,10.28 11.71,10.41 arc90 11.43,10.69 8.88,10.69 8.26,11.31 8.26,31.74 7.5,32.49 3.53,32.49 v3.05,32
VCC
  Top 0.203: USBA.VBUS 43.09,5.45 _VCC.TP
  Top 0.406: USBA.VBUS 40.97,5.78 F1.2 40.97,8.11 40.69,8.38 40.69,9.08 R14.2 C12.2
VDD  (via drill 0.3, 0.81)
  Top 0.203: R3.1 17.65,43.01 v17.68,42.98
  Top 0.813: SKW.P$22 5.74,23.01 v1.83,23.01 1.83,38.25 1.07,39.01 1.07,41 1.98,41.91 2.74,41.91 v2.59,42.06 | v2.59,42.06 5.74,42.06 SKW.P$52 | SKW.P$50 3.23,40.82 2.9,41.15 2.9,41.76 v2.59,42.06
  Bottom 0.152: U$1.P$4 33.29,39.39 34.9,41 35.51,41 U$1.P$5 35.81,41.91 34.59,43.13 32.61,43.13 32.16,42.67 28.96,42.67 28.1,41.82 R1.2 | R1.2 R2.2 | R2.2 R6.2 28.1,35.91 R4.2 28,35.81 27.43,35.81 26.98,36.27 C3.2 | C1.2 26.88,39.22 27.28,39.62 28.05,39.62 R1.2 | C2.1 26.97,37.79 27.43,38.25 27.95,38.25 R2.2 | U$2.P$4 33.9,21.31 U$2.P$5 | R8.2 28.05,23.02 28.19,23.16 30.48,23.16 32.31,24.99 | R8.2 R7.2 | C6.2 26.98,18.9 27.43,18.44 R10.1 R9.1 R7.2 | C5.1 26.87,21.84 27.28,22.25 28,22.25 R8.2 | C4.2 26.77,20.37 27.43,21.03 R7.2
  Bottom 0.203: v2.59,42.06 1.52,43.13 1.52,48.01 2.13,48.62 3.51,48.62 VDD.TP | C8.1 7.9,40.8 C9.1 9.14,40.87 9.14,42.67 9.75,43.28 16.76,43.28 17.07,42.98 v17.68,42.98 18.29,42.37 19.66,42.37 19.96,42.06 21.34,42.06 21.49,42.22 25.3,42.22 25.9,41.62 C1.2 | 32.31,24.99 34.59,24.99 35.81,23.77 | _VDD.TP C19.1
  Bottom 0.406: U$1.P$5 43.59,41.3 44.96,39.93 44.96,25.15 43.59,23.77 35.81,23.77 U$2.P$5
  Bottom 0.813: C18.2 4.93,1.88 5.18,2.13 5.18,4.06 C19.1 5.03,4.22 5.03,6.25 3.94,7.34 LDO.2 3.94,13.59 3.35,14.17 1.98,14.17 1.37,14.78 1.37,17.83 1.68,18.14 3.31,18.14 C11.1 3.39,20.55 C10.1 3.42,23.01 C7.1 1.85,23.04 v1.83,23.01 | C8.1 3.71,40.87 3.66,40.82 3.23,40.82 2.59,41.45 v2.59,42.06
W_LED
  Top 0.203: SKW.P$55 15.27,44.63 15.54,44.35 16.21,44.35 R5.1
WLAN_LED  (via drill 0.3)
  Top 0.203: SKW.P$54 3.13,43.36 v2.74,43.74 | v20.73,42.82 20.73,44.15 R12.1
  Bottom 0.203: v2.74,43.74 19.81,43.74 v20.73,42.82
WRX_N
  Top 0.331: U$1.P$6 34.59,40.61 34.59,37.95 35.05,37.49 37.49,37.49 37.83,37.15 37.83,34.71 28.39,25.26 13.72,25.26 13.37,25.6 10.87,25.6 SKW.P$25
  Bottom 0.152: R1.1 31.9,39.67 33.22,41 33.22,41.88 U$1.P$6
WRX_P
  Top 0.331: U$1.P$3 35.91,38.86 37.64,38.86 38.37,38.14 38.37,34.48 35.18,31.3 arc90 35.18,30.92 35.55,30.55 arc-90 35.55,30.17 35.31,29.93 arc-90 34.93,29.93 34.56,30.3 arc90 34.19,30.3 33.95,30.07 arc90 33.95,29.69 34.32,29.32 arc-90 34.32,28.94 34.08,28.7 arc-90 33.7,28.7 33.33,29.07 arc90 32.95,29.07 28.61,24.73 13.72,24.73 13.3,24.31 SKW.P$23
  Bottom 0.152: R2.1 31.55,38.4 31.85,38.1 35.15,38.1 U$1.P$3
WTX_N
  Top 0.331: U$1.P$2 33.27,35.48 30.37,32.58 28.91,32.58 arc-90 28.6,32.88 28.6,32.98 arc90 28.3,33.28 27.55,33.28 arc90 27.25,32.98 27.25,32.88 arc-90 26.94,32.58 26.2,32.58 arc-90 25.89,32.88 25.89,32.98 arc90 25.59,33.28 24.84,33.28 arc90 24.54,32.98 24.54,32.88 arc-90 24.23,32.58 21.38,32.58 16.65,27.85 13.72,27.85 13.49,28.08 10.88,28.08 SKW.P$29
  Bottom 0.152: R6.1 32.99,37.13 U$1.P$2
WTX_P
  Top 0.331: U$1.P$1 34.77,36.22 30.51,31.96 21.6,31.96 16.95,27.32 13.72,27.32 13.34,26.94 10.93,26.94 SKW.P$27
  Bottom 0.152: R4.1 32.11,35.86 32.46,35.51 34.06,35.51 34.71,36.16 35.75,36.16 U$1.P$1

### Text on the board
tPlace: 2015 | LAN | PocketMdm | Rated Input Supply | 5V - 1A DC | WLAN